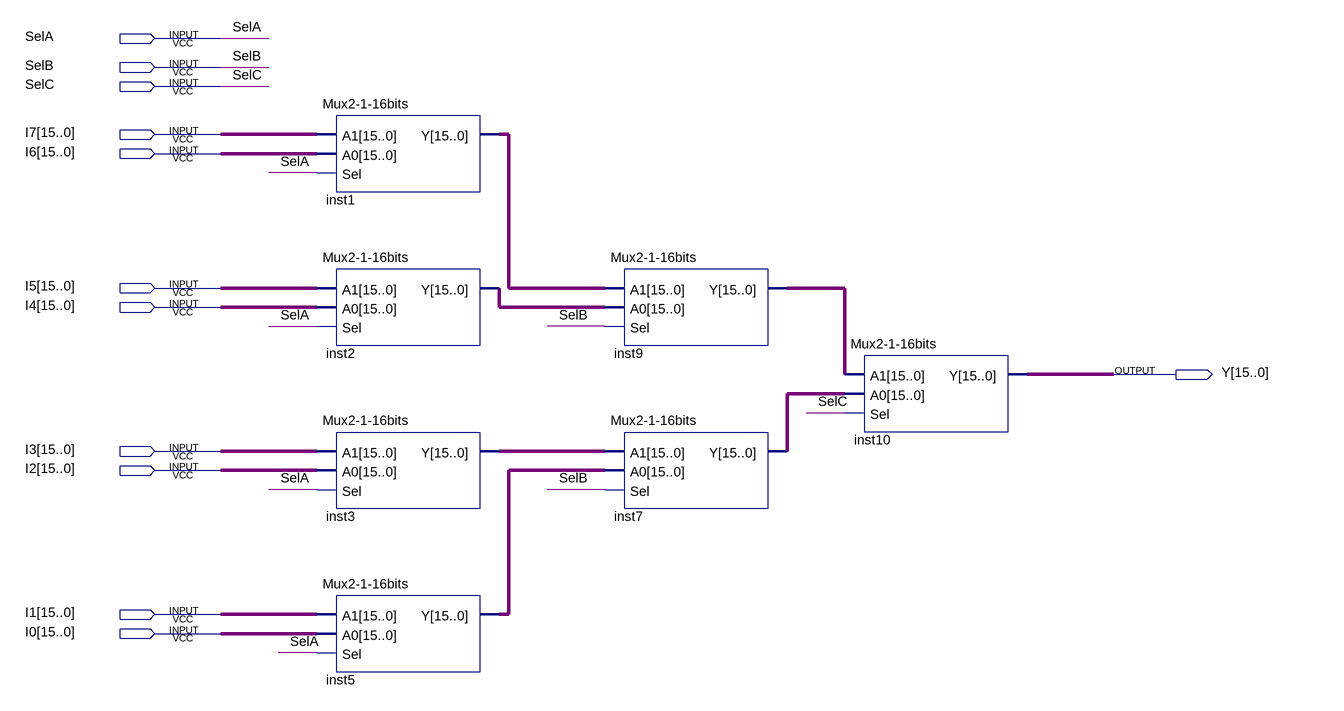
[diagram p0: schematic sheet]
// Quartus schematic Mux8-1-16bits.bdf as structural Verilog: 7 symbols, 12 pins
module \Mux8-1-16bits  (
  input  SelA,
  input  SelB,
  input  SelC,
  input  [15:0] I7,
  input  [15:0] I6,
  input  [15:0] I5,
  input  [15:0] I4,
  input  [15:0] I3,
  input  [15:0] I2,
  input  [15:0] I1,
  input  [15:0] I0,
  output [15:0] Y
);

  wire [15:0] inst1_y, inst2_y, inst3_y, inst5_y, inst7_y, inst9_y;

  \Mux2-1-16bits  inst1 (.A1(I7), .A0(I6), .Sel(SelA), .Y(inst1_y));
  \Mux2-1-16bits  inst2 (.A1(I5), .A0(I4), .Sel(SelA), .Y(inst2_y));
  \Mux2-1-16bits  inst3 (.A1(I3), .A0(I2), .Sel(SelA), .Y(inst3_y));
  \Mux2-1-16bits  inst5 (.A1(I1), .A0(I0), .Sel(SelA), .Y(inst5_y));
  \Mux2-1-16bits  inst9 (.A1(inst1_y), .A0(inst2_y), .Sel(SelB), .Y(inst9_y));
  \Mux2-1-16bits  inst7 (.A1(inst3_y), .A0(inst5_y), .Sel(SelB), .Y(inst7_y));
  \Mux2-1-16bits  inst10 (.A1(inst9_y), .A0(inst7_y), .Sel(SelC), .Y(Y));
endmodule
